# EAGLE schematic happyboardDIP2battery (EAGLE 5.06)

## Sheet 1 of 6
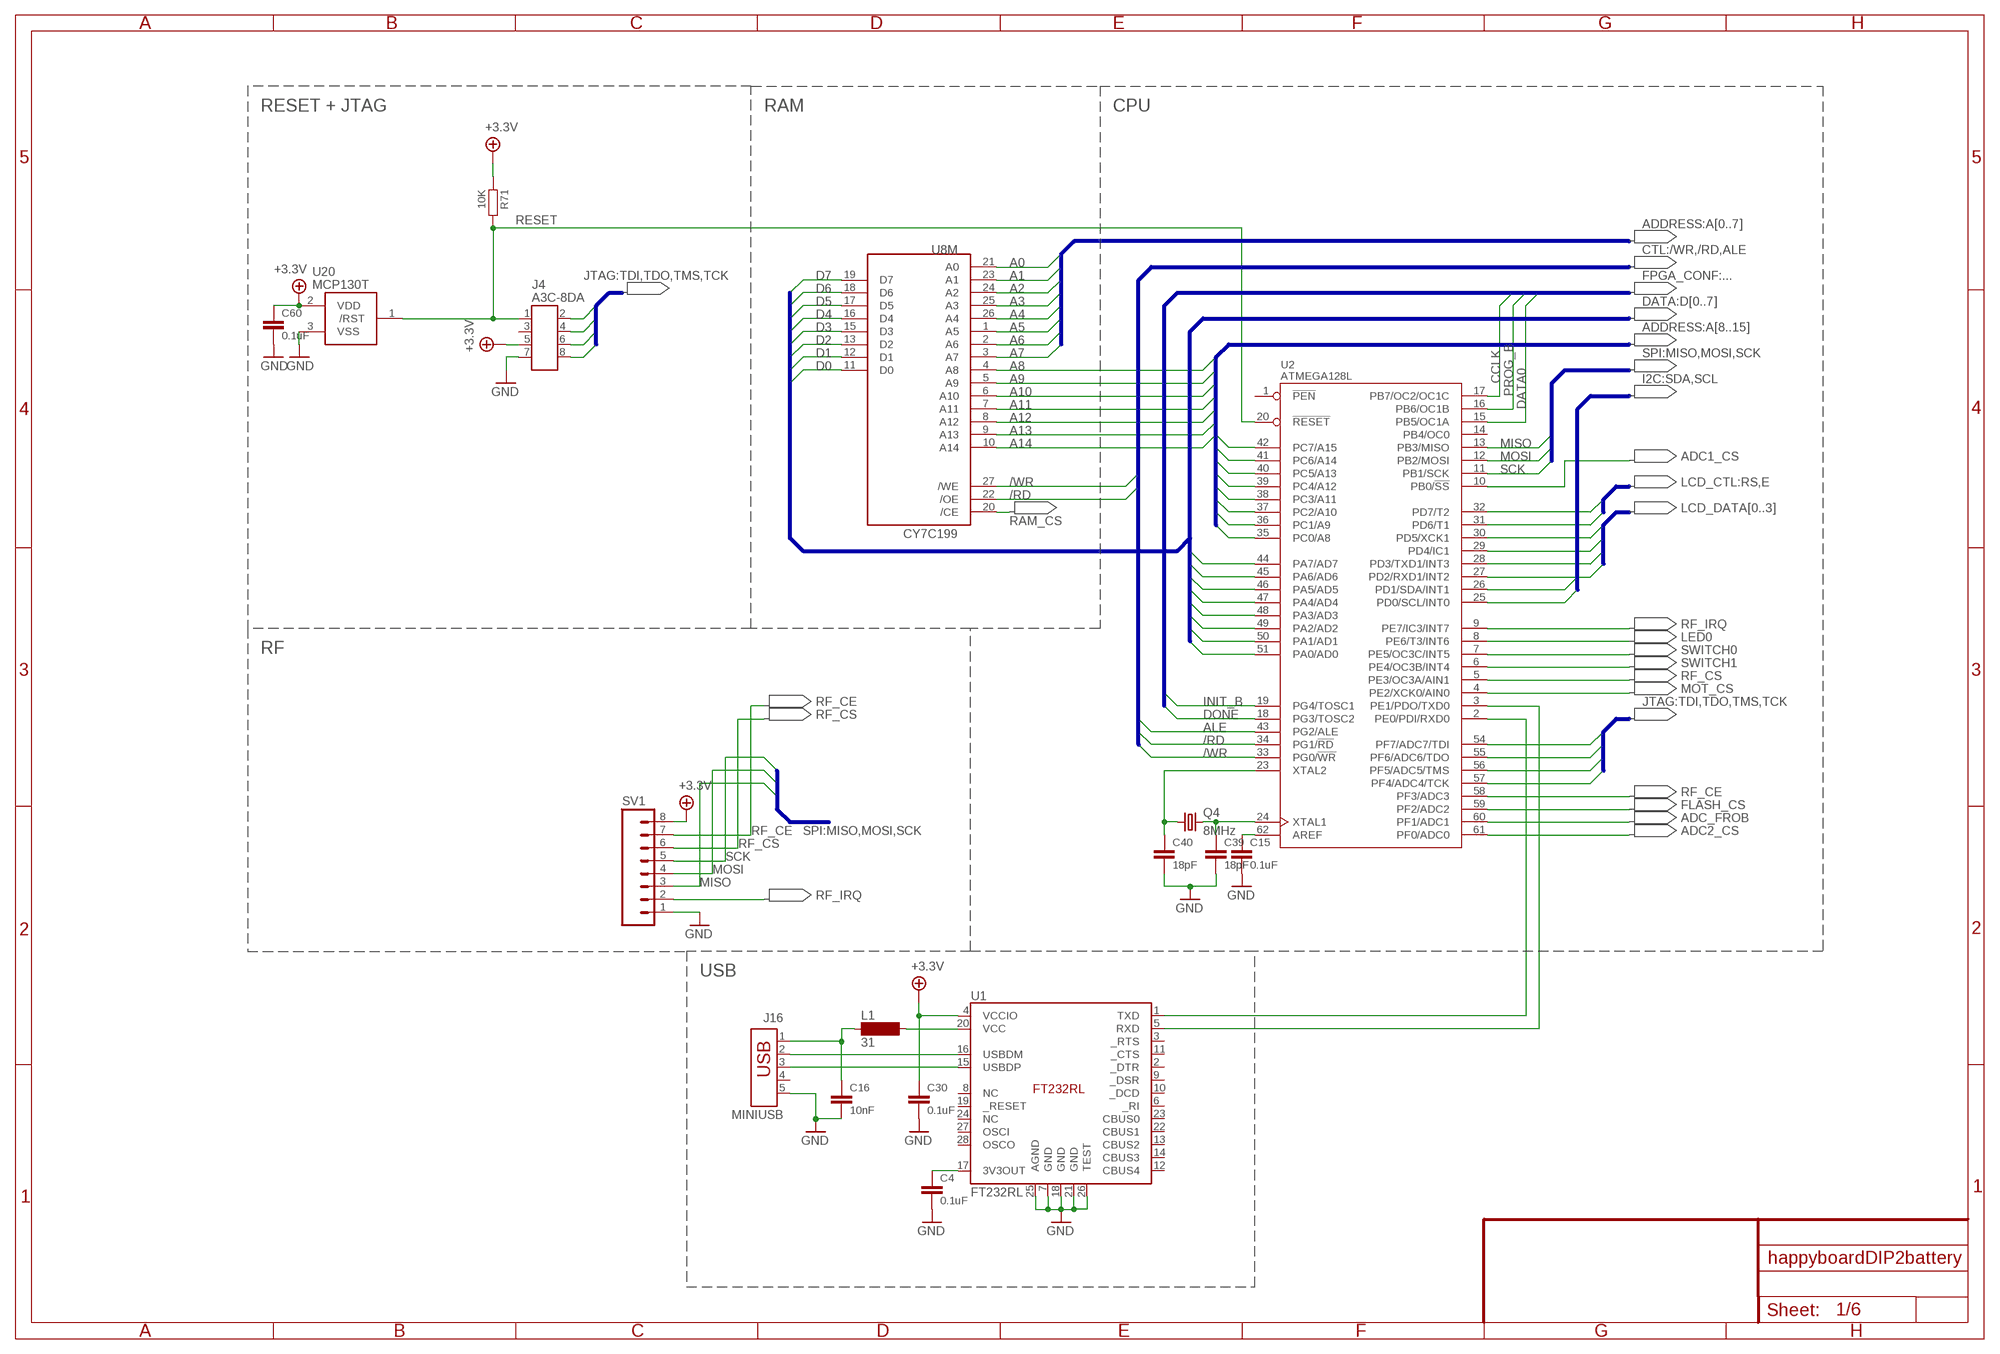
[diagram p0: schematic, sheet 1]

### Parts
C4  0.1uF  C0603  [C0603]
C15  0.1uF  C0603  [C0603]
C16  10nF  C0603  [C0603]
C30  0.1uF  C0603  [C0603]
C39  18pF  C0603  [C0603]
C40  18pF  C0603  [C0603]
C60  0.1uF  C0603  [C0603]
J4  A3C-8DA  [A3C-8DA]
J16  MINIUSB  [UX60A-MB-5SY]
L1  31  SM-1206  [SM-1206]
Q4  8MHz  CRYSTALSM49  [SM49]
R71  10K  R0603  [R0603]
SV1  M08  [1X08]
U1  FT232RL  [SSOP-28]
U2  ATMEGA128L  ATMEGA128-AC  [TQFP64]
U8  CY7C199  CY7C1994  [SOJ28-4]
U20  MCP130T  [SOT23]

### Nets
+3.3V: C30.1 C60.1 J4.5(S5) R71.1 SV1.8 U1.4(VCCIO) U20.2(VDD) ; also sheet 2,3,4,5,6
/RD: U2.34(PG1/!RD) U8.22(M:/OE) ; also sheet 2
/WR: U2.33(PG0/!WR) U8.27(M:/WE) ; also sheet 2
A0: U8.21(M:A0) ; also sheet 2
A1: U8.23(M:A1) ; also sheet 2
A2: U8.24(M:A2) ; also sheet 2
A3: U8.25(M:A3) ; also sheet 2
A4: U8.26(M:A4) ; also sheet 2
A5: U8.1(M:A5) ; also sheet 2
A6: U8.2(M:A6) ; also sheet 2
A7: U8.3(M:A7) ; also sheet 2
A8: U2.35(PC0/A8) U8.4(M:A8) ; also sheet 2
A9: U2.36(PC1/A9) U8.5(M:A9) ; also sheet 2
A10: U2.37(PC2/A10) U8.6(M:A10) ; also sheet 2
A11: U2.38(PC3/A11) U8.7(M:A11) ; also sheet 2
A12: U2.39(PC4/A12) U8.8(M:A12) ; also sheet 2
A13: U2.40(PC5/A13) U8.9(M:A13) ; also sheet 2
A14: U2.41(PC6/A14) U8.10(M:A14) ; also sheet 2
A15: U2.42(PC7/A15) ; also sheet 2
ADC1_CS: U2.10(PB0/!SS) ; also sheet 4
ADC2_CS: U2.61(PF0/ADC0) ; also sheet 4
ADC_FROB: U2.60(PF1/ADC1) ; also sheet 5
ALE: U2.43(PG2/ALE) ; also sheet 2
CCLK: U2.17(PB7/OC2/OC1C) ; also sheet 2
D0: U2.51(PA0/AD0) U8.11(M:D0) ; also sheet 2
D1: U2.50(PA1/AD1) U8.12(M:D1) ; also sheet 2
D2: U2.49(PA2/AD2) U8.13(M:D2) ; also sheet 2
D3: U2.48(PA3/AD3) U8.15(M:D3) ; also sheet 2
D4: U2.47(PA4/AD4) U8.16(M:D4) ; also sheet 2
D5: U2.46(PA5/AD5) U8.17(M:D5) ; also sheet 2
D6: U2.45(PA6/AD6) U8.18(M:D6) ; also sheet 2
D7: U2.44(PA7/AD7) U8.19(M:D7) ; also sheet 2
DATA0: U2.15(PB5/OC1A) ; also sheet 2
DONE: U2.18(PG3/TOSC2) ; also sheet 2
E: U2.31(PD6/T1) ; also sheet 5
FLASH_CS: U2.59(PF2/ADC2) ; also sheet 5
GND: C4.2 C15.2 C16.2 C30.2 C39.2 C40.2 C60.2 J4.7(S7) J16.5 SV1.1 U1.7(GND) U1.18(GND) U1.21(GND) U1.25(AGND) U1.26(TEST) U20.3(VSS) ; also sheet 2,3,4,5,6
INIT_B: U2.19(PG4/TOSC1) ; also sheet 2
LCD_DATA0: U2.27(PD2/RXD1/INT2) ; also sheet 5
LCD_DATA1: U2.28(PD3/TXD1/INT3) ; also sheet 5
LCD_DATA2: U2.29(PD4/IC1) ; also sheet 5
LCD_DATA3: U2.30(PD5/XCK1) ; also sheet 5
LED0: U2.8(PE6/T3/INT6) ; also sheet 5
MISO: SV1.3 U2.13(PB3/MISO) ; also sheet 3,4,5
MOSI: SV1.4 U2.12(PB2/MOSI) ; also sheet 3,4,5
MOT_CS: U2.4(PE2/XCK0/AIN0) ; also sheet 3
N$1: J16.3 U1.15(USBDP)
N$3: C39.1 Q4.2 U2.24(XTAL1)
N$5: C4.1 U1.17(3V3OUT)
N$8: J16.2 U1.16(USBDM)
N$9: L1.2 U1.20(VCC)
N$10: C16.1 J16.1 L1.1
N$14: C40.1 Q4.1 U2.23(XTAL2)
N$42: C15.1 U2.62(AREF)
PE0: U1.1(TXD) U2.2(PE0/PDI/RXD0)
PE1: U1.5(RXD) U2.3(PE1/PDO/TXD0)
PROG_B: U2.16(PB6/OC1B) ; also sheet 2
RAM_CS: U8.20(M:/CE) ; also sheet 2
RESET: J4.1(S1) R71.2 U2.20(!RESET) U20.1(/RST)
RF_CE: SV1.7 U2.58(PF3/ADC3)
RF_CS: SV1.6 U2.5(PE3/OC3A/AIN1)
RF_IRQ: SV1.2 U2.9(PE7/IC3/INT7)
RS: U2.32(PD7/T2) ; also sheet 5
SCK: SV1.5 U2.11(PB1/SCK) ; also sheet 3,4,5
SCL: U2.25(PD0/SCL/INT0) ; also sheet 5
SDA: U2.26(PD1/SDA/INT1) ; also sheet 5
SWITCH0: U2.7(PE5/OC3C/INT5) ; also sheet 5
SWITCH1: U2.6(PE4/OC3B/INT4) ; also sheet 5
TCK: J4.8(S8) U2.57(PF4/ADC4/TCK)
TDI: J4.2(S2) U2.54(PF7/ADC7/TDI)
TDO: J4.4(S4) U2.55(PF6/ADC6/TDO)
TMS: J4.6(S6) U2.56(PF5/ADC5/TMS)
Unconnected: J4.3(S3) J16.4 U1.2(_DTR) U1.3(_RTS) U1.6(_RI) U1.8(NC) U1.9(_DSR) U1.10(_DCD) U1.11(_CTS) U1.12(CBUS4) U1.13(CBUS2) U1.14(CBUS3) U1.19(_RESET) U1.22(CBUS1) U1.23(CBUS0) U1.24(NC) U1.27(OSCI) U1.28(OSCO) U2.1(!PEN) U2.14(PB4/OC0)

### Buses
ADDRESS:A[8..15]
DATA:D[0..7]
CTL:/WR,/RD,ALE
SPI:MISO,MOSI,SCK
I2C:SDA,SCL
FPGA_CONF:CCLK,DONE,PROG_B,INIT_B,DATA0
LCD_DATA[0..3]
LCD_CTL:RS,E
ADDRESS:A[0..7]
JTAG:TDI,TDO,TMS,TCK

### Notes on the sheet
- RESET + JTAG | RAM | CPU
- FPGA_CONF:...
- RF
- USB

## Sheet 2 of 6
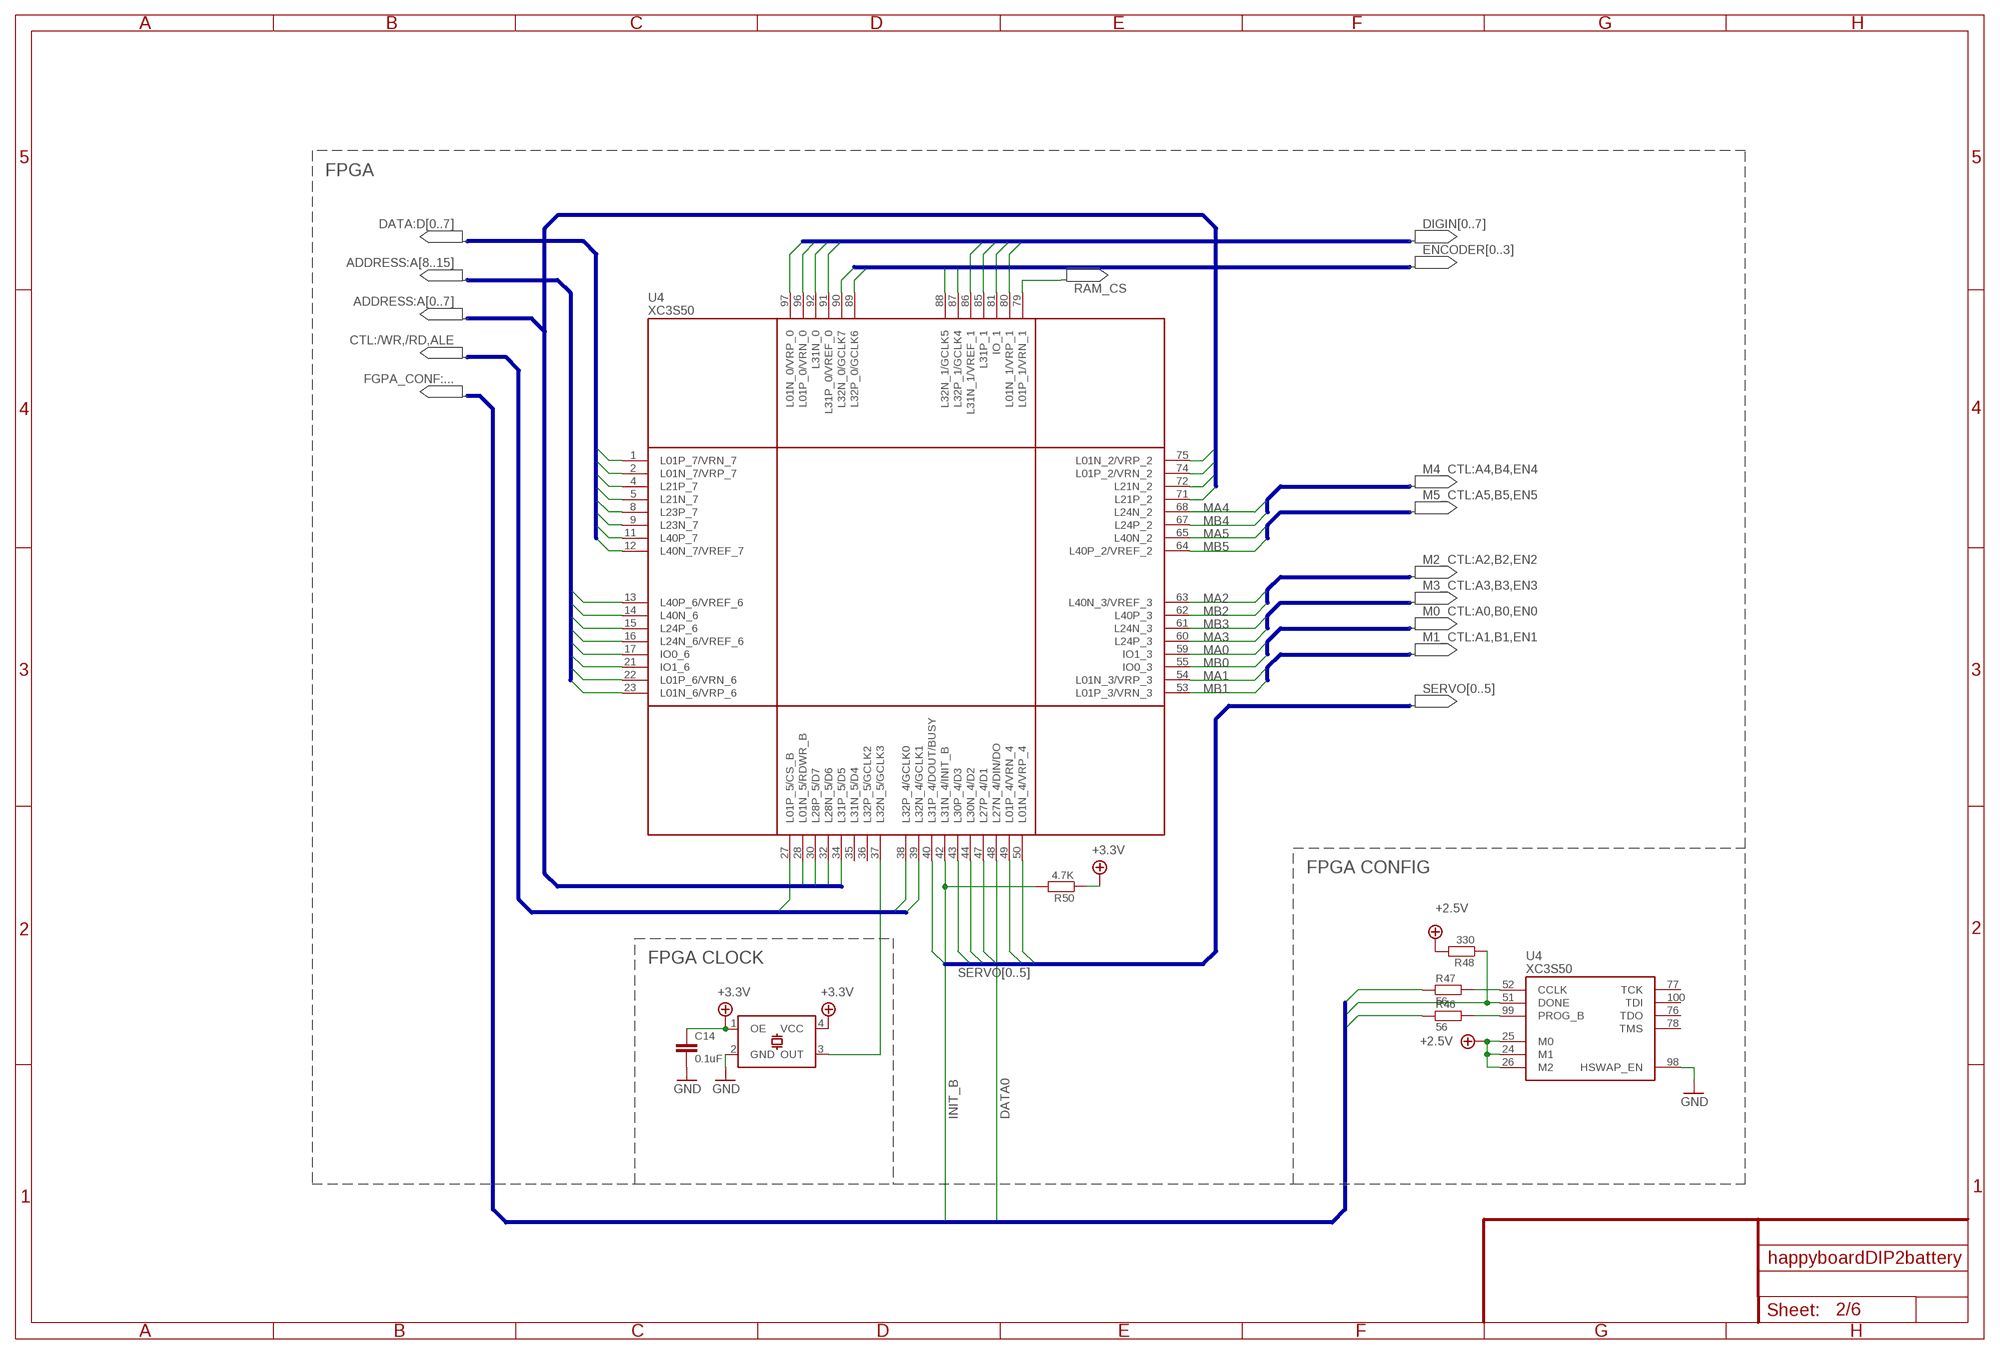
[diagram p1: schematic, sheet 2]

### Parts
C14  0.1uF  C0603  [C0603]
Q2  8MHz  CITIZEN-CRYSTAL  [CITIZEN-CRYSTAL]
R46  56  R0603  [R0603]
R47  56  R0603  [R0603]
R48  330  R0603  [R0603]
R50  4.7K  R0603  [R0603]
U4  XC3S50  [VQ100]

### Nets
+2.5V: R48.2 U4.24(M1) U4.25(M0) U4.26(M2) ; also sheet 6
+3.3V: C14.1 Q2.1(OE) Q2.4(VCC) R50.1 ; also sheet 1,3,4,5,6
/RD: U4.39(L32N_4/GCLK1) ; also sheet 1
/WR: U4.38(L32P_4/GCLK0) ; also sheet 1
A0: U4.28(L01N_5/RDWR_B) ; also sheet 1
A1: U4.30(L28P_5/D7) ; also sheet 1
A2: U4.32(L28N_5/D6) ; also sheet 1
A3: U4.34(L31P_5/D5) ; also sheet 1
A4: U4.75(L01N_2/VRP_2) ; also sheet 1
A5: U4.74(L01P_2/VRN_2) ; also sheet 1
A6: U4.72(L21N_2) ; also sheet 1
A7: U4.71(L21P_2) ; also sheet 1
A8: U4.23(L01N_6/VRP_6) ; also sheet 1
A9: U4.22(L01P_6/VRN_6) ; also sheet 1
A10: U4.21(IO1_6) ; also sheet 1
A11: U4.17(IO0_6) ; also sheet 1
A12: U4.16(L24N_6/VREF_6) ; also sheet 1
A13: U4.15(L24P_6) ; also sheet 1
A14: U4.14(L40N_6) ; also sheet 1
A15: U4.13(L40P_6/VREF_6) ; also sheet 1
ALE: U4.27(L01P_5/CS_B) ; also sheet 1
CCLK: R47.1 ; also sheet 1
D0: U4.1(L01P_7/VRN_7) ; also sheet 1
D1: U4.2(L01N_7/VRP_7) ; also sheet 1
D2: U4.4(L21P_7) ; also sheet 1
D3: U4.5(L21N_7) ; also sheet 1
D4: U4.8(L23P_7) ; also sheet 1
D5: U4.9(L23N_7) ; also sheet 1
D6: U4.11(L40P_7) ; also sheet 1
D7: U4.12(L40N_7/VREF_7) ; also sheet 1
DATA0: U4.48(L27N_4/DIN/DO) ; also sheet 1
DIGIN0: U4.80(L01N_1/VRP_1) ; also sheet 4
DIGIN1: U4.81(IO_1) ; also sheet 4
DIGIN2: U4.85(L31P_1) ; also sheet 4
DIGIN3: U4.86(L31N_1/VREF_1) ; also sheet 4
DIGIN4: U4.91(L31P_0/VREF_0) ; also sheet 4
DIGIN5: U4.92(L31N_0) ; also sheet 4
DIGIN6: U4.96(L01P_0/VRN_0) ; also sheet 4
DIGIN7: U4.97(L01N_0/VRP_0) ; also sheet 4
DONE: R48.1 U4.51(DONE) ; also sheet 1
ENCODER0: U4.87(L32P_1/GCLK4) ; also sheet 4
ENCODER1: U4.88(L32N_1/GCLK5) ; also sheet 4
ENCODER2: U4.90(L32N_0/GCLK7) ; also sheet 4
ENCODER3: U4.89(L32P_0/GCLK6) ; also sheet 4
GND: C14.2 Q2.2(GND) U4.98(HSWAP_EN) ; also sheet 1,3,4,5,6
INIT_B: R50.2 U4.42(L31N_4/INIT_B) ; also sheet 1
MA0: U4.59(IO1_3) ; also sheet 3
MA1: U4.54(L01N_3/VRP_3) ; also sheet 3
MA2: U4.63(L40N_3/VREF_3) ; also sheet 3
MA3: U4.60(L24P_3) ; also sheet 3
MA4: U4.68(L24N_2) ; also sheet 3
MA5: U4.65(L40N_2) ; also sheet 3
MB0: U4.55(IO0_3) ; also sheet 3
MB1: U4.53(L01P_3/VRN_3) ; also sheet 3
MB2: U4.62(L40P_3) ; also sheet 3
MB3: U4.61(L24N_3) ; also sheet 3
MB4: U4.67(L24P_2) ; also sheet 3
MB5: U4.64(L40P_2/VREF_2) ; also sheet 3
N$97: Q2.3(OUT) U4.37(L32N_5/GCLK3)
N$99: R46.2 U4.99(PROG_B)
N$100: R47.2 U4.52(CCLK)
PROG_B: R46.1 ; also sheet 1
RAM_CS: U4.79(L01P_1/VRN_1) ; also sheet 1
SERVO0: U4.40(L31P_4/DOUT/BUSY) ; also sheet 4
SERVO1: U4.43(L30P_4/D3) ; also sheet 4
SERVO2: U4.44(L30N_4/D2) ; also sheet 4
SERVO3: U4.47(L27P_4/D1) ; also sheet 4
SERVO4: U4.49(L01P_4/VRN_4) ; also sheet 4
SERVO5: U4.50(L01N_4/VRP_4) ; also sheet 4
Unconnected: U4.35(L31N_5/D4) U4.36(L32P_5/GCLK2) U4.76(TDO) U4.77(TCK) U4.78(TMS) U4.100(TDI)

### Buses
FPGA_CONF:CCLK,DONE,PROG_B,INIT_B,DATA0
ADDRESS:A[8..15]
DATA:D[0..7]
CTL:/WR,/RD,ALE
SERVO[0..5]
M0_CTL:A0,B0,EN0
M1_CTL:A1,B1,EN1
M2_CTL:A2,B2,EN2
M3_CTL:A3,B3,EN3
M4_CTL:A4,B4,EN4
M5_CTL:A5,B5,EN5
ENCODER[0..3]
DIGIN[0..7]
ADDRESS:A[0..7]

### Notes on the sheet
- FPGA
- FGPA_CONF:...
- FPGA CONFIG
- FPGA CLOCK

## Sheet 3 of 6
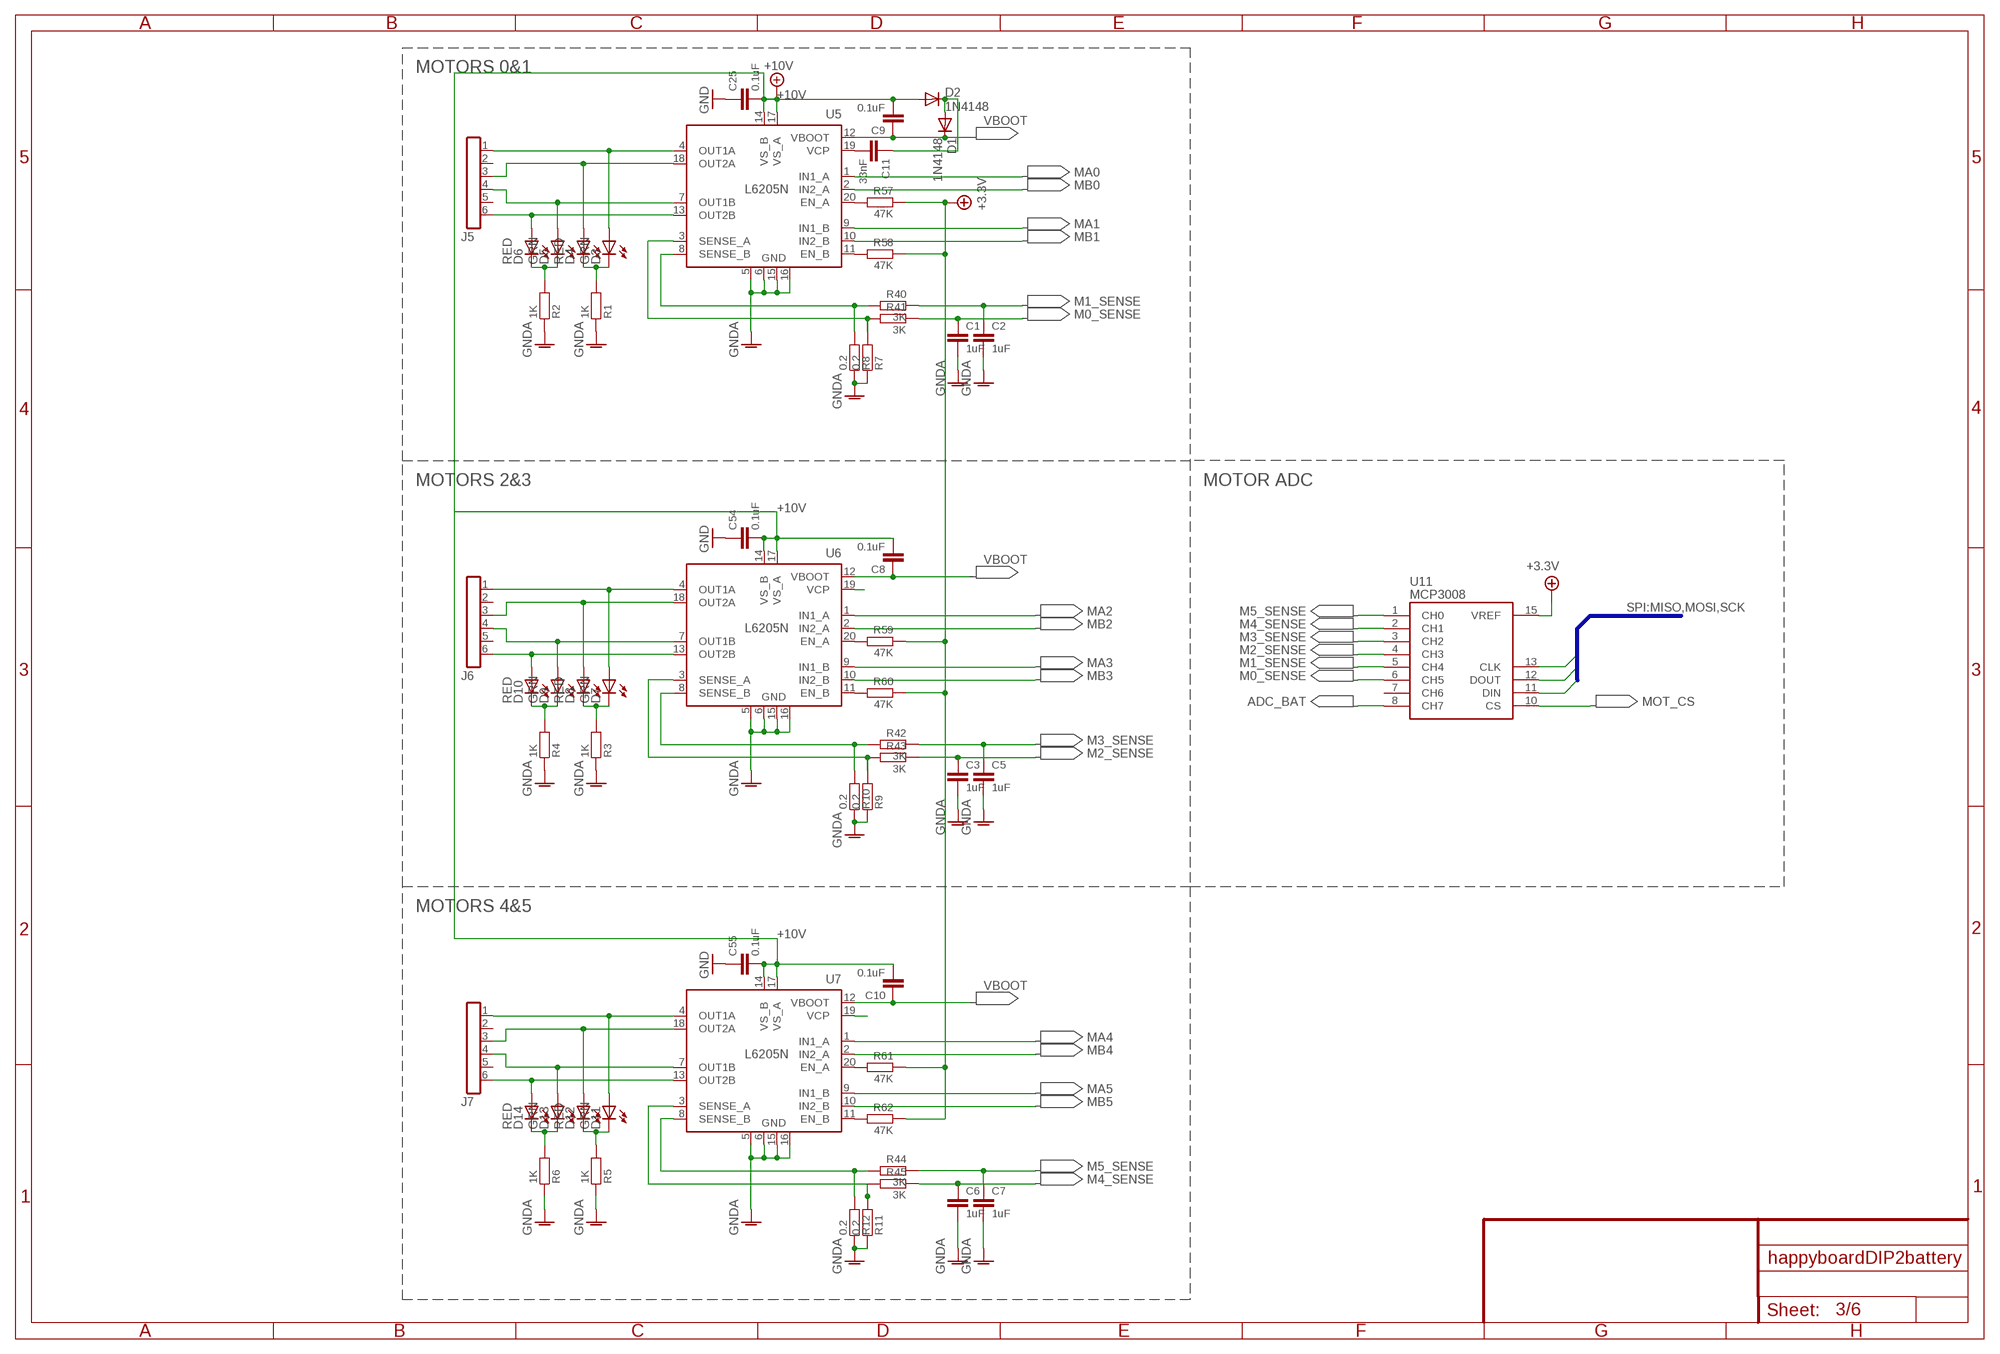
[diagram p2: schematic, sheet 3]

### Parts
C1  1uF  C0603  [C0603]
C2  1uF  C0603  [C0603]
C3  1uF  C0603  [C0603]
C5  1uF  C0603  [C0603]
C6  1uF  C0603  [C0603]
C7  1uF  C0603  [C0603]
C8  0.1uF  C0603  [C0603]
C9  0.1uF  C0603  [C0603]
C10  0.1uF  C0603  [C0603]
C11  33nF  C0603  [C0603]
C25  0.1uF  C0603  [C0603]
C54  0.1uF  C0603  [C0603]
C55  0.1uF  C0603  [C0603]
D1  1N4148  DIODE-SOD323  [SOD323]
D2  1N4148  DIODE-SOD323  [SOD323]
D3  GRN  LED  [CHIP-LED0603]
D4  RED  LED  [CHIP-LED0603]
D5  GRN  LED  [CHIP-LED0603]
D6  RED  LED  [CHIP-LED0603]
D7  GRN  LED  [CHIP-LED0603]
D8  RED  LED  [CHIP-LED0603]
D9  GRN  LED  [CHIP-LED0603]
D10  RED  LED  [CHIP-LED0603]
D11  GRN  LED  [CHIP-LED0603]
D12  RED  LED  [CHIP-LED0603]
D13  GRN  LED  [CHIP-LED0603]
D14  RED  LED  [CHIP-LED0603]
J5  6x1 Pin Female Header  FE06-1  [FE06]
J6  6x1 Pin Female Header  FE06-1  [FE06]
J7  6x1 Pin Female Header  FE06-1  [FE06]
R1  1K  R0603  [R0603]
R2  1K  R0603  [R0603]
R3  1K  R0603  [R0603]
R4  1K  R0603  [R0603]
R5  1K  R0603  [R0603]
R6  1K  R0603  [R0603]
R7  0.2  R1206  [R1206]
R8  0.2  R1206  [R1206]
R9  0.2  R1206  [R1206]
R10  0.2  R1206  [R1206]
R11  0.2  R1206  [R1206]
R12  0.2  R1206  [R1206]
R40  3K  R0603  [R0603]
R41  3K  R0603  [R0603]
R42  3K  R0603  [R0603]
R43  3K  R0603  [R0603]
R44  3K  R0603  [R0603]
R45  3K  R0603  [R0603]
R57  47K  R0603  [R0603]
R58  47K  R0603  [R0603]
R59  47K  R0603  [R0603]
R60  47K  R0603  [R0603]
R61  47K  R0603  [R0603]
R62  47K  R0603  [R0603]
U5  L6205N  [DIL20]
U6  L6205N  [DIL20]
U7  L6205N  [DIL20]
U11  MCP3008  [SO16]

### Nets
+3.3V: R57.1 R58.1 R59.1 R60.1 R61.1 R62.1 U11.15(1:VREF) ; also sheet 1,2,4,5,6
+10V: C8.2 C9.2 C10.2 C25.2 C54.2 C55.2 D2.A U5.14(VS_B) U5.17(VS_A) U6.14(VS_B) U6.17(VS_A) U7.14(VS_B) U7.17(VS_A) ; also sheet 6
ADC_BAT: U11.8(1:CH7) ; also sheet 6
GND: C25.1 C54.1 C55.1 ; also sheet 1,2,4,5,6
GNDA: C1.2 C2.2 C3.2 C5.2 C6.2 C7.2 R1.1 R2.1 R3.1 R4.1 R5.1 R6.1 R7.1 R8.1 R9.1 R10.1 R11.1 R12.1 U5.5(GND) U5.6(GND) U5.15(GND) U5.16(GND) U6.5(GND) U6.6(GND) U6.15(GND) U6.16(GND) U7.5(GND) U7.6(GND) U7.15(GND) U7.16(GND) ; also sheet 4,6
M0_SENSE: C1.1 R41.1 U11.6(1:CH5)
M1_SENSE: C2.1 R40.1 U11.5(1:CH4)
M2_SENSE: C3.1 R43.1 U11.4(1:CH3)
M3_SENSE: C5.1 R42.1 U11.3(1:CH2)
M4_SENSE: C6.1 R45.1 U11.2(1:CH1)
M5_SENSE: C7.1 R44.1 U11.1(1:CH0)
MA0: U5.1(IN1_A) ; also sheet 2
MA1: U5.9(IN1_B) ; also sheet 2
MA2: U6.1(IN1_A) ; also sheet 2
MA3: U6.9(IN1_B) ; also sheet 2
MA4: U7.1(IN1_A) ; also sheet 2
MA5: U7.9(IN1_B) ; also sheet 2
MB0: U5.2(IN2_A) ; also sheet 2
MB1: U5.10(IN2_B) ; also sheet 2
MB2: U6.2(IN2_A) ; also sheet 2
MB3: U6.10(IN2_B) ; also sheet 2
MB4: U7.2(IN2_A) ; also sheet 2
MB5: U7.10(IN2_B) ; also sheet 2
MISO: U11.12(1:DOUT) ; also sheet 1,4,5
MOSI: U11.11(1:DIN) ; also sheet 1,4,5
MOT_CS: U11.10(1:CS) ; also sheet 1
N$2: D11.A J7.1 U7.4(OUT1A)
N$13: D14.A J7.6 U7.13(OUT2B)
N$19: D13.A J7.4 U7.7(OUT1B)
N$25: D12.A J7.3 U7.18(OUT2A)
N$26: D3.A J5.1 U5.4(OUT1A)
N$27: D6.A J5.6 U5.13(OUT2B)
N$28: D5.A J5.4 U5.7(OUT1B)
N$29: D4.A J5.3 U5.18(OUT2A)
N$30: D7.A J6.1 U6.4(OUT1A)
N$31: D8.A J6.3 U6.18(OUT2A)
N$32: D9.A J6.4 U6.7(OUT1B)
N$33: D10.A J6.6 U6.13(OUT2B)
N$34: D5.C D6.C R2.2
N$35: D3.C D4.C R1.2
N$36: D9.C D10.C R4.2
N$37: D7.C D8.C R3.2
N$38: D11.C D12.C R5.2
N$39: D13.C D14.C R6.2
N$43: C11.1 D1.A D2.C
N$44: R11.2 R45.2 U7.3(SENSE_A)
N$45: R8.2 R40.2 U5.8(SENSE_B)
N$54: U7.19(VCP)
N$58: R57.2 U5.20(EN_A)
N$59: R58.2 U5.11(EN_B)
N$60: R59.2 U6.20(EN_A)
N$61: R60.2 U6.11(EN_B)
N$62: R10.2 R42.2 U6.8(SENSE_B)
N$63: R7.2 R41.2 U5.3(SENSE_A)
N$64: R61.2 U7.20(EN_A)
N$65: R62.2 U7.11(EN_B)
N$70: C11.2 U5.19(VCP)
N$93: U6.19(VCP)
N$94: R9.2 R43.2 U6.3(SENSE_A)
N$95: R12.2 R44.2 U7.8(SENSE_B)
SCK: U11.13(1:CLK) ; also sheet 1,4,5
VBOOT: C8.1 C9.1 C10.1 D1.C U5.12(VBOOT) U6.12(VBOOT) U7.12(VBOOT)
Unconnected: J5.2 J5.5 J6.2 J6.5 J7.2 J7.5 U11.7(1:CH6)

### Buses
SPI:MISO,MOSI,SCK

### Notes on the sheet
- MOTORS 0&1
- MOTORS 2&3 | MOTOR ADC
- MOTORS 4&5

## Sheet 4 of 6
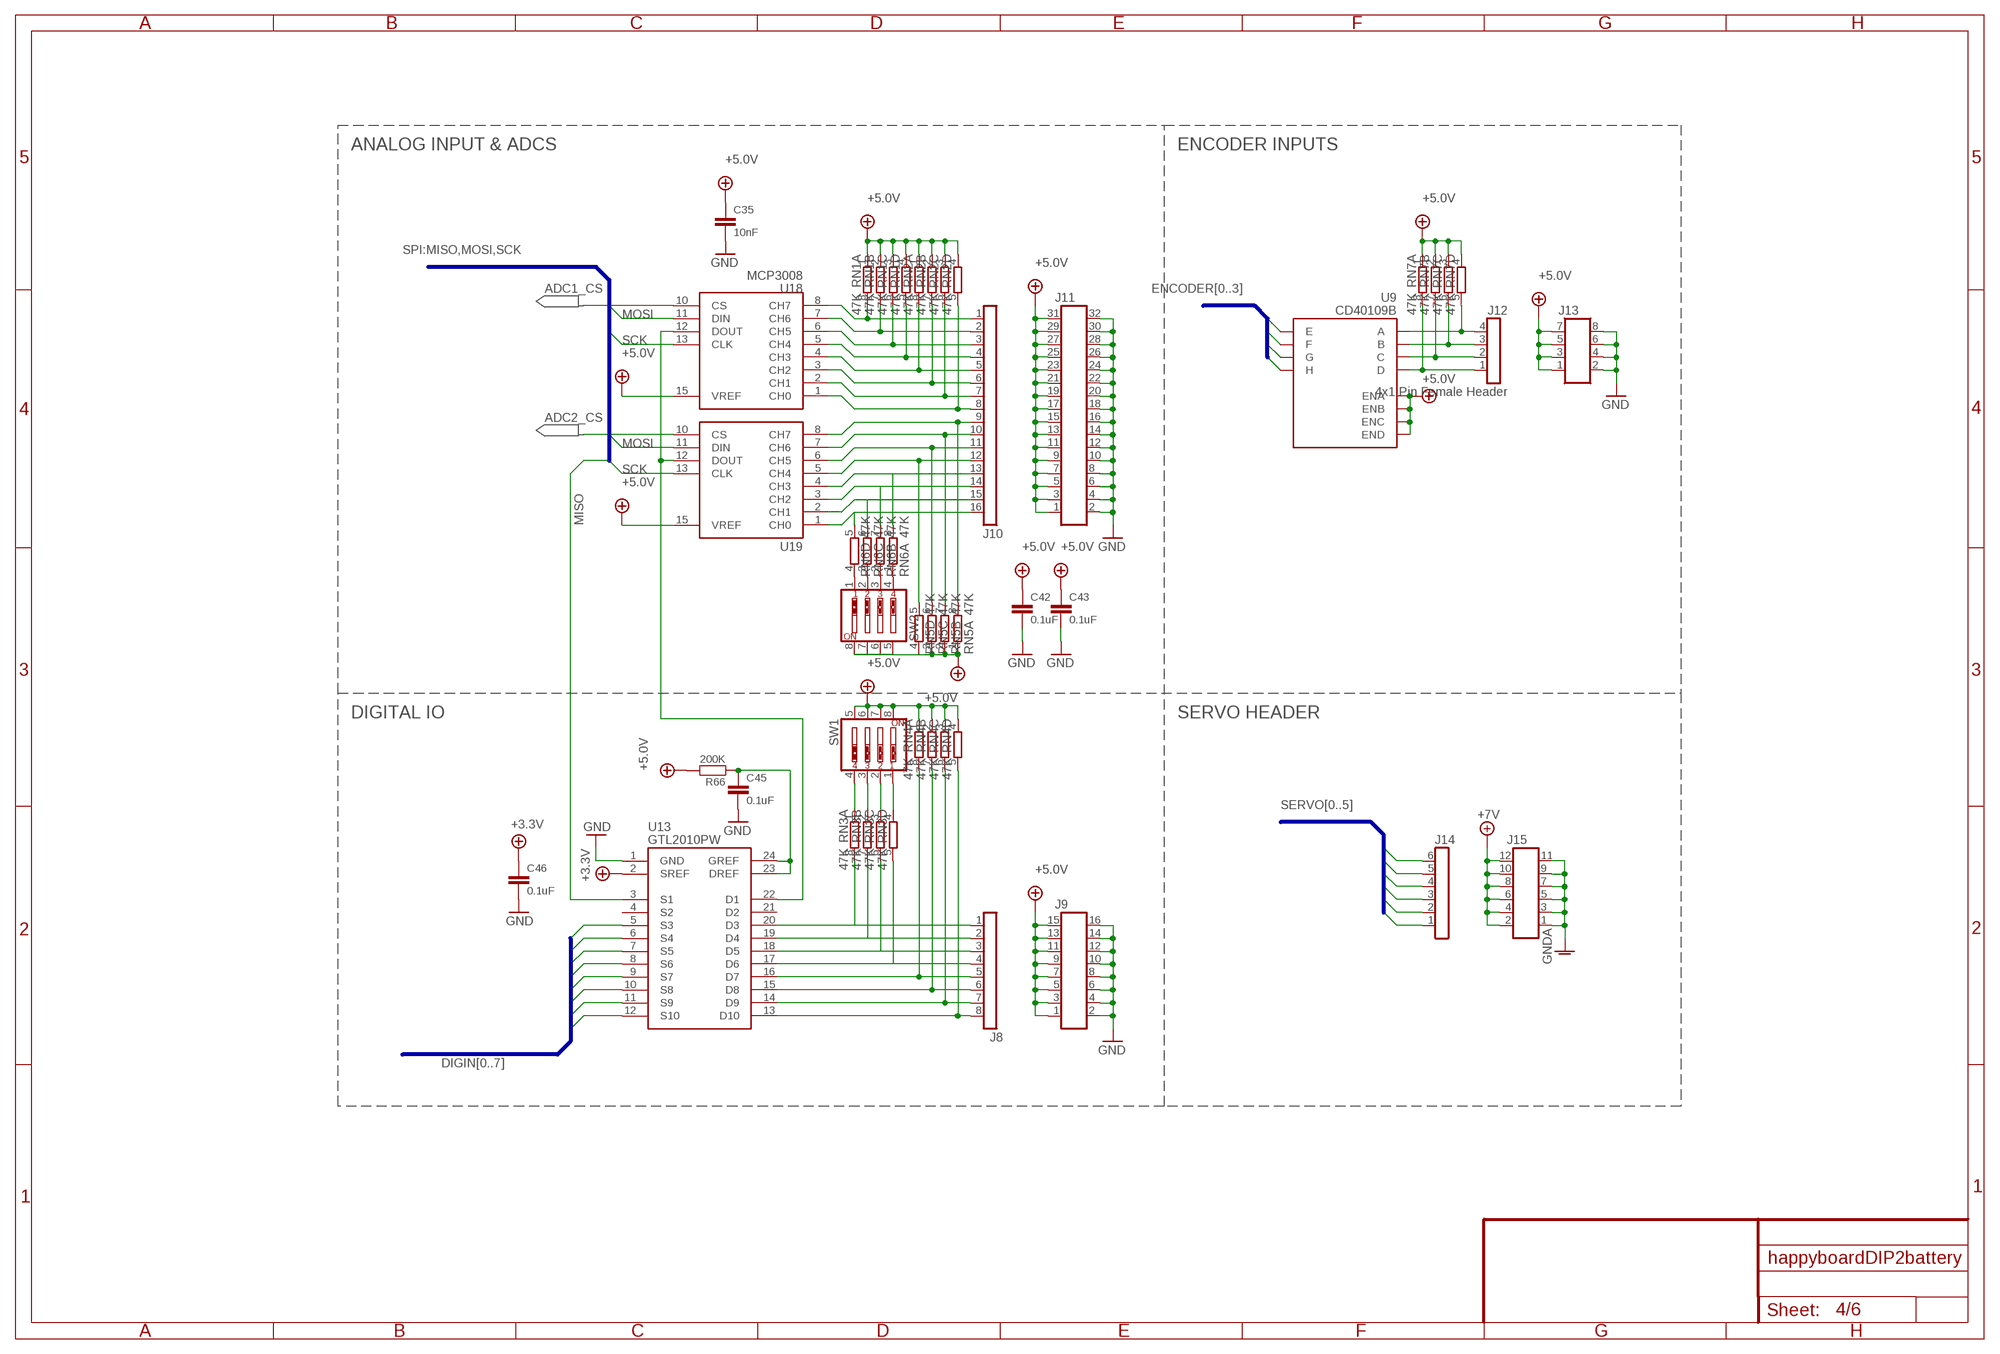
[diagram p3: schematic, sheet 4]

### Parts
C35  10nF  C0603  [C0603]
C42  0.1uF  C0603  [C0603]
C43  0.1uF  C0603  [C0603]
C45  0.1uF  C0603  [C0603]
C46  0.1uF  C0603  [C0603]
J8  8x1 Pin Female Header  FE08-1  [FE08]
J9  8x2 Pin Female Header  FE08-2  [FE08-2]
J10  16x1 Pin Female Header  FE16-1  [FE16-1]
J11  16x2 Pin Female Header  FE16-2  [FE16-2]
J12  4x1 Pin Female Header  FE04-1  [FE04-1]
J13  4x2 Pin Female Header  FE04-2  [FE04-2]
J14  6x1 Pin Male Header  MA06-1  [MA06-1]
J15  6x2 Pin Male Header  MA06-2  [MA06-2]
R66  200K  R0603  [R0603]
RN1  47K  4R-N0603-ARC  [0603-ARC]
RN2  47K  4R-N0603-ARC  [0603-ARC]
RN3  47K  4R-N0603-ARC  [0603-ARC]
RN4  47K  4R-N0603-ARC  [0603-ARC]
RN5  47K  4R-N0603-ARC  [0603-ARC]
RN6  47K  4R-N0603-ARC  [0603-ARC]
RN7  47K  4R-N0603-ARC  [0603-ARC]
SW1  SW_DIP-4  [EDG-04]
SW2  SW_DIP-4  [EDG-04]
U9  CD40109B  [TSSOP16]
U13  GTL2010PW  [TSSOP24]
U18  MCP3008  [SO16]
U19  MCP3008  [SO16]

### Nets
+3.3V: C46.1 U13.2(SREF) ; also sheet 1,2,3,5,6
+5.0V: C35.1 C42.1 C43.1 J9.1 J9.3 J9.5 J9.7 J9.9 J9.11 J9.13 J9.15 J11.1 J11.3 J11.5 J11.7 J11.9 J11.11 J11.13 J11.15 J11.17 J11.19 J11.21 J11.23 J11.25 J11.27 J11.29 J11.31 J13.1 J13.3 J13.5 J13.7 R66.2 RN1.1 RN1.2 RN1.3 RN1.4 RN2.1 RN2.2 RN2.3 RN2.4 RN4.1 RN4.2 RN4.3 RN4.4 RN5.1 RN5.2 RN5.3 RN5.4 RN7.1 RN7.2 RN7.3 RN7.4 SW1.5 SW1.6 SW1.7 SW1.8 SW2.5 SW2.6 SW2.7 SW2.8 U9.2(ENA) U9.7(ENB) U9.9(ENC) U9.15(END) U18.15(1:VREF) U19.15(1:VREF) ; also sheet 6
ADC1_CS: U18.10(1:CS) ; also sheet 1
ADC2_CS: U19.10(1:CS) ; also sheet 1
DIGIN0: U13.5(S3) ; also sheet 2
DIGIN1: U13.6(S4) ; also sheet 2
DIGIN2: U13.7(S5) ; also sheet 2
DIGIN3: U13.8(S6) ; also sheet 2
DIGIN4: U13.9(S7) ; also sheet 2
DIGIN5: U13.10(S8) ; also sheet 2
DIGIN6: U13.11(S9) ; also sheet 2
DIGIN7: U13.12(S10) ; also sheet 2
ENCODER0: U9.13(H) ; also sheet 2
ENCODER1: U9.11(G) ; also sheet 2
ENCODER2: U9.5(F) ; also sheet 2
ENCODER3: U9.4(E) ; also sheet 2
GND: C35.2 C42.2 C43.2 C45.2 C46.2 J9.2 J9.4 J9.6 J9.8 J9.10 J9.12 J9.14 J9.16 J11.2 J11.4 J11.6 J11.8 J11.10 J11.12 J11.14 J11.16 J11.18 J11.20 J11.22 J11.24 J11.26 J11.28 J11.30 J11.32 J13.2 J13.4 J13.6 J13.8 U13.1(GND) ; also sheet 1,2,3,5,6
GNDA: J15.1 J15.3 J15.5 J15.7 J15.9 J15.11 ; also sheet 3,6
MISO: U13.3(S1) ; also sheet 1,3,5
MOSI: U18.11(1:DIN) U19.11(1:DIN) ; also sheet 1,3,5
N$4: RN3.1 SW1.4
N$6: J15.2 J15.4 J15.6 J15.8 J15.10 J15.12 ; supply symbol labelled +7V
N$7: J10.1 RN1.8 U18.8(1:CH7)
N$11: J10.2 RN1.7 U18.7(1:CH6)
N$15: RN6.1 SW2.4
N$16: J10.15 RN6.6 U19.2(1:CH1)
N$17: J10.14 RN6.7 U19.3(1:CH2)
N$20: J10.13 RN6.8 U19.4(1:CH3)
N$22: J10.12 RN5.5 U19.5(1:CH4)
N$24: J10.11 RN5.6 U19.6(1:CH5)
N$46: J10.10 RN5.7 U19.7(1:CH6)
N$47: J10.9 RN5.8 U19.8(1:CH7)
N$48: J10.8 RN2.5 U18.1(1:CH0)
N$49: J10.7 RN2.6 U18.2(1:CH1)
N$50: J10.6 RN2.7 U18.3(1:CH2)
N$51: J10.5 RN2.8 U18.4(1:CH3)
N$52: J10.4 RN1.5 U18.5(1:CH4)
N$53: J10.3 RN1.6 U18.6(1:CH5)
N$57: RN3.2 SW1.3
N$66: J12.1 RN7.8 U9.14(D)
N$67: J12.2 RN7.7 U9.10(C)
N$68: J12.3 RN7.6 U9.6(B)
N$69: J12.4 RN7.5 U9.3(A)
N$71: J8.8 RN4.5 U13.13(D10)
N$72: J8.7 RN4.6 U13.14(D9)
N$73: J8.6 RN4.7 U13.15(D8)
N$74: J8.5 RN4.8 U13.16(D7)
N$75: J8.4 RN3.5 U13.17(D6)
N$76: J8.3 RN3.6 U13.18(D5)
N$77: J8.2 RN3.7 U13.19(D4)
N$78: J8.1 RN3.8 U13.20(D3)
N$82: RN3.3 SW1.2
N$87: C45.1 R66.1 U13.23(DREF) U13.24(GREF)
N$89: U13.22(D1) U18.12(1:DOUT) U19.12(1:DOUT)
N$96: RN3.4 SW1.1
N$98: J10.16 RN6.5 U19.1(1:CH0)
N$101: RN6.2 SW2.3
N$102: RN6.3 SW2.2
N$103: RN6.4 SW2.1
SCK: U18.13(1:CLK) U19.13(1:CLK) ; also sheet 1,3,5
SERVO0: J14.1 ; also sheet 2
SERVO1: J14.2 ; also sheet 2
SERVO2: J14.3 ; also sheet 2
SERVO3: J14.4 ; also sheet 2
SERVO4: J14.5 ; also sheet 2
SERVO5: J14.6 ; also sheet 2
Unconnected: U13.4(S2) U13.21(D2)

### Buses
SERVO[0..5]
DIGIN[0..7]
SPI:MISO,MOSI,SCK
ENCODER[0..3]

### Notes on the sheet
- ANALOG INPUT & ADCS | ENCODER INPUTS
- DIGITAL IO | SERVO HEADER

## Sheet 5 of 6
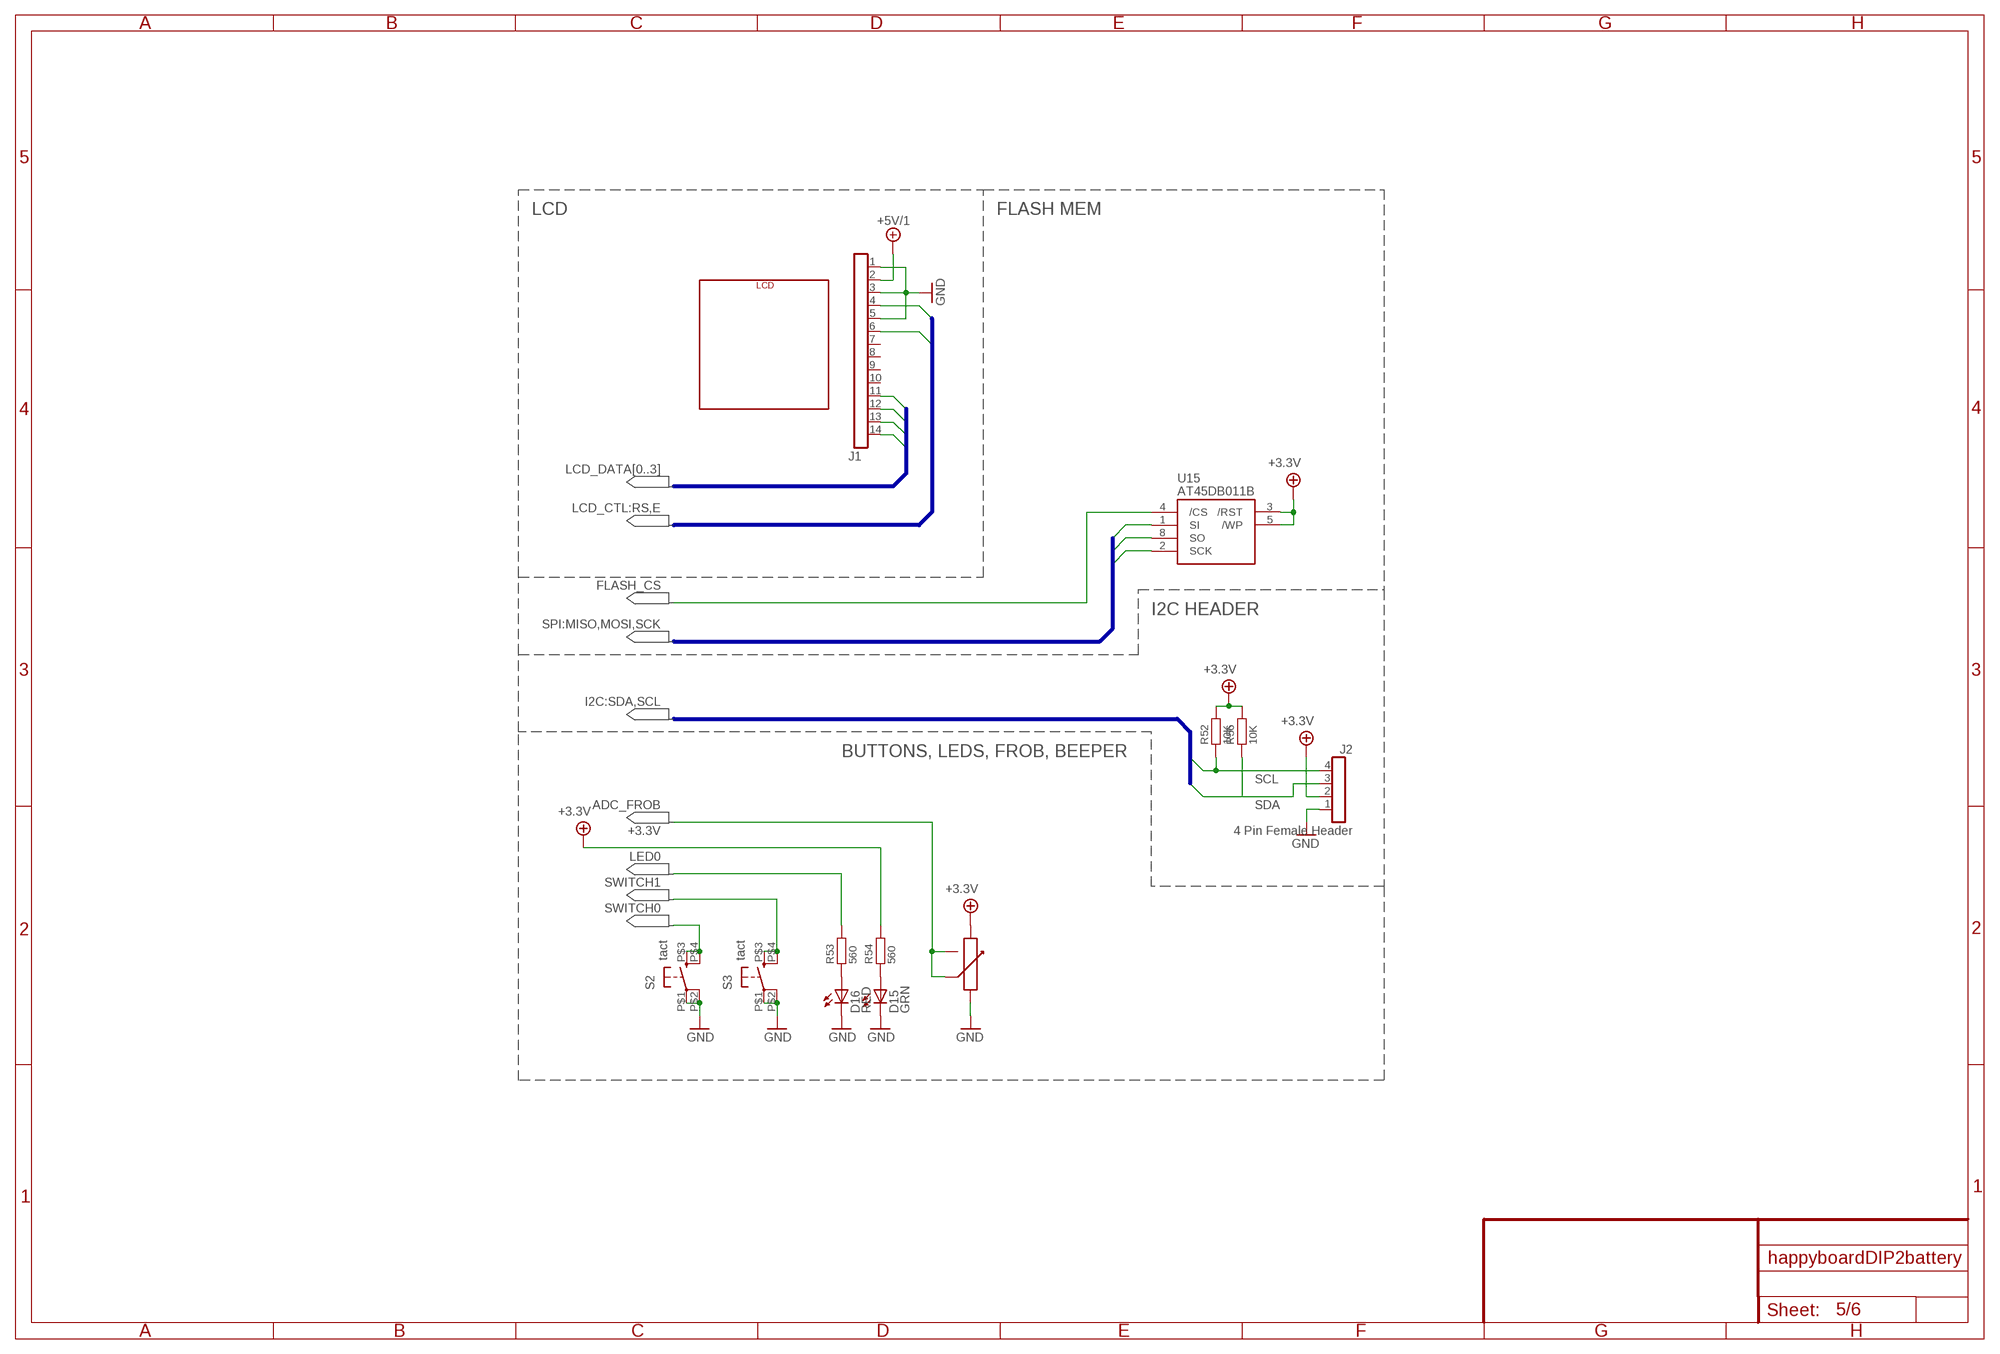
[diagram p4: schematic, sheet 5]

### Parts
D15  GRN  LED  [CHIP-LED0603]
D16  RED  LED  [CHIP-LED0603]
DISP1  16X2LCD  [16X2LCD]
J1  14 Pin Female Header  FE14-1  [FE14]
J2  4 Pin Female Header  FE04-1  [FE04-1]
R52  10K  R0603  [R0603]
R53  560  R0603  [R0603]
R54  560  R0603  [R0603]
R56  10K  R0603  [R0603]
S2  tact  TL3301  [TL3301]
S3  tact  TL3301  [TL3301]
U15  AT45DB011B  [SO8]
VR1  FROBKNOB  [FROBKNOB]

### Nets
+3.3V: J2.2 R52.2 R54.2 R56.2 U15.3(1:/RST) U15.5(1:/WP) VR1.1 ; also sheet 1,2,3,4,6
+5V/1: J1.2 ; also sheet 6
ADC_FROB: VR1.2A VR1.2B ; also sheet 1
E: J1.6 ; also sheet 1
FLASH_CS: U15.4(1:/CS) ; also sheet 1
GND: D15.C D16.C J1.1 J1.3 J1.5 J2.1 S2.P$1(P) S2.P$2(P1) S3.P$1(P) S3.P$2(P1) VR1.3 ; also sheet 1,2,3,4,6
LCD_DATA0: J1.11 ; also sheet 1
LCD_DATA1: J1.12 ; also sheet 1
LCD_DATA2: J1.13 ; also sheet 1
LCD_DATA3: J1.14 ; also sheet 1
LED0: R53.2 ; also sheet 1
MISO: U15.8(1:SO) ; also sheet 1,3,4
MOSI: U15.1(1:SI) ; also sheet 1,3,4
N$40: D16.A R53.1
N$41: D15.A R54.1
RS: J1.4 ; also sheet 1
SCK: U15.2(1:SCK) ; also sheet 1,3,4
SCL: J2.4 R52.1 ; also sheet 1
SDA: J2.3 R56.1 ; also sheet 1
SWITCH0: S2.P$3(S) S2.P$4(S1) ; also sheet 1
SWITCH1: S3.P$3(S) S3.P$4(S1) ; also sheet 1
Unconnected: J1.7 J1.8 J1.9 J1.10

### Buses
LCD_DATA[0..3]
LCD_CTL:RS,E
I2C:SDA,SCL
SPI:MISO,MOSI,SCK

### Notes on the sheet
- LCD | FLASH MEM
- I2C HEADER
- BUTTONS, LEDS, FROB, BEEPER

## Sheet 6 of 6
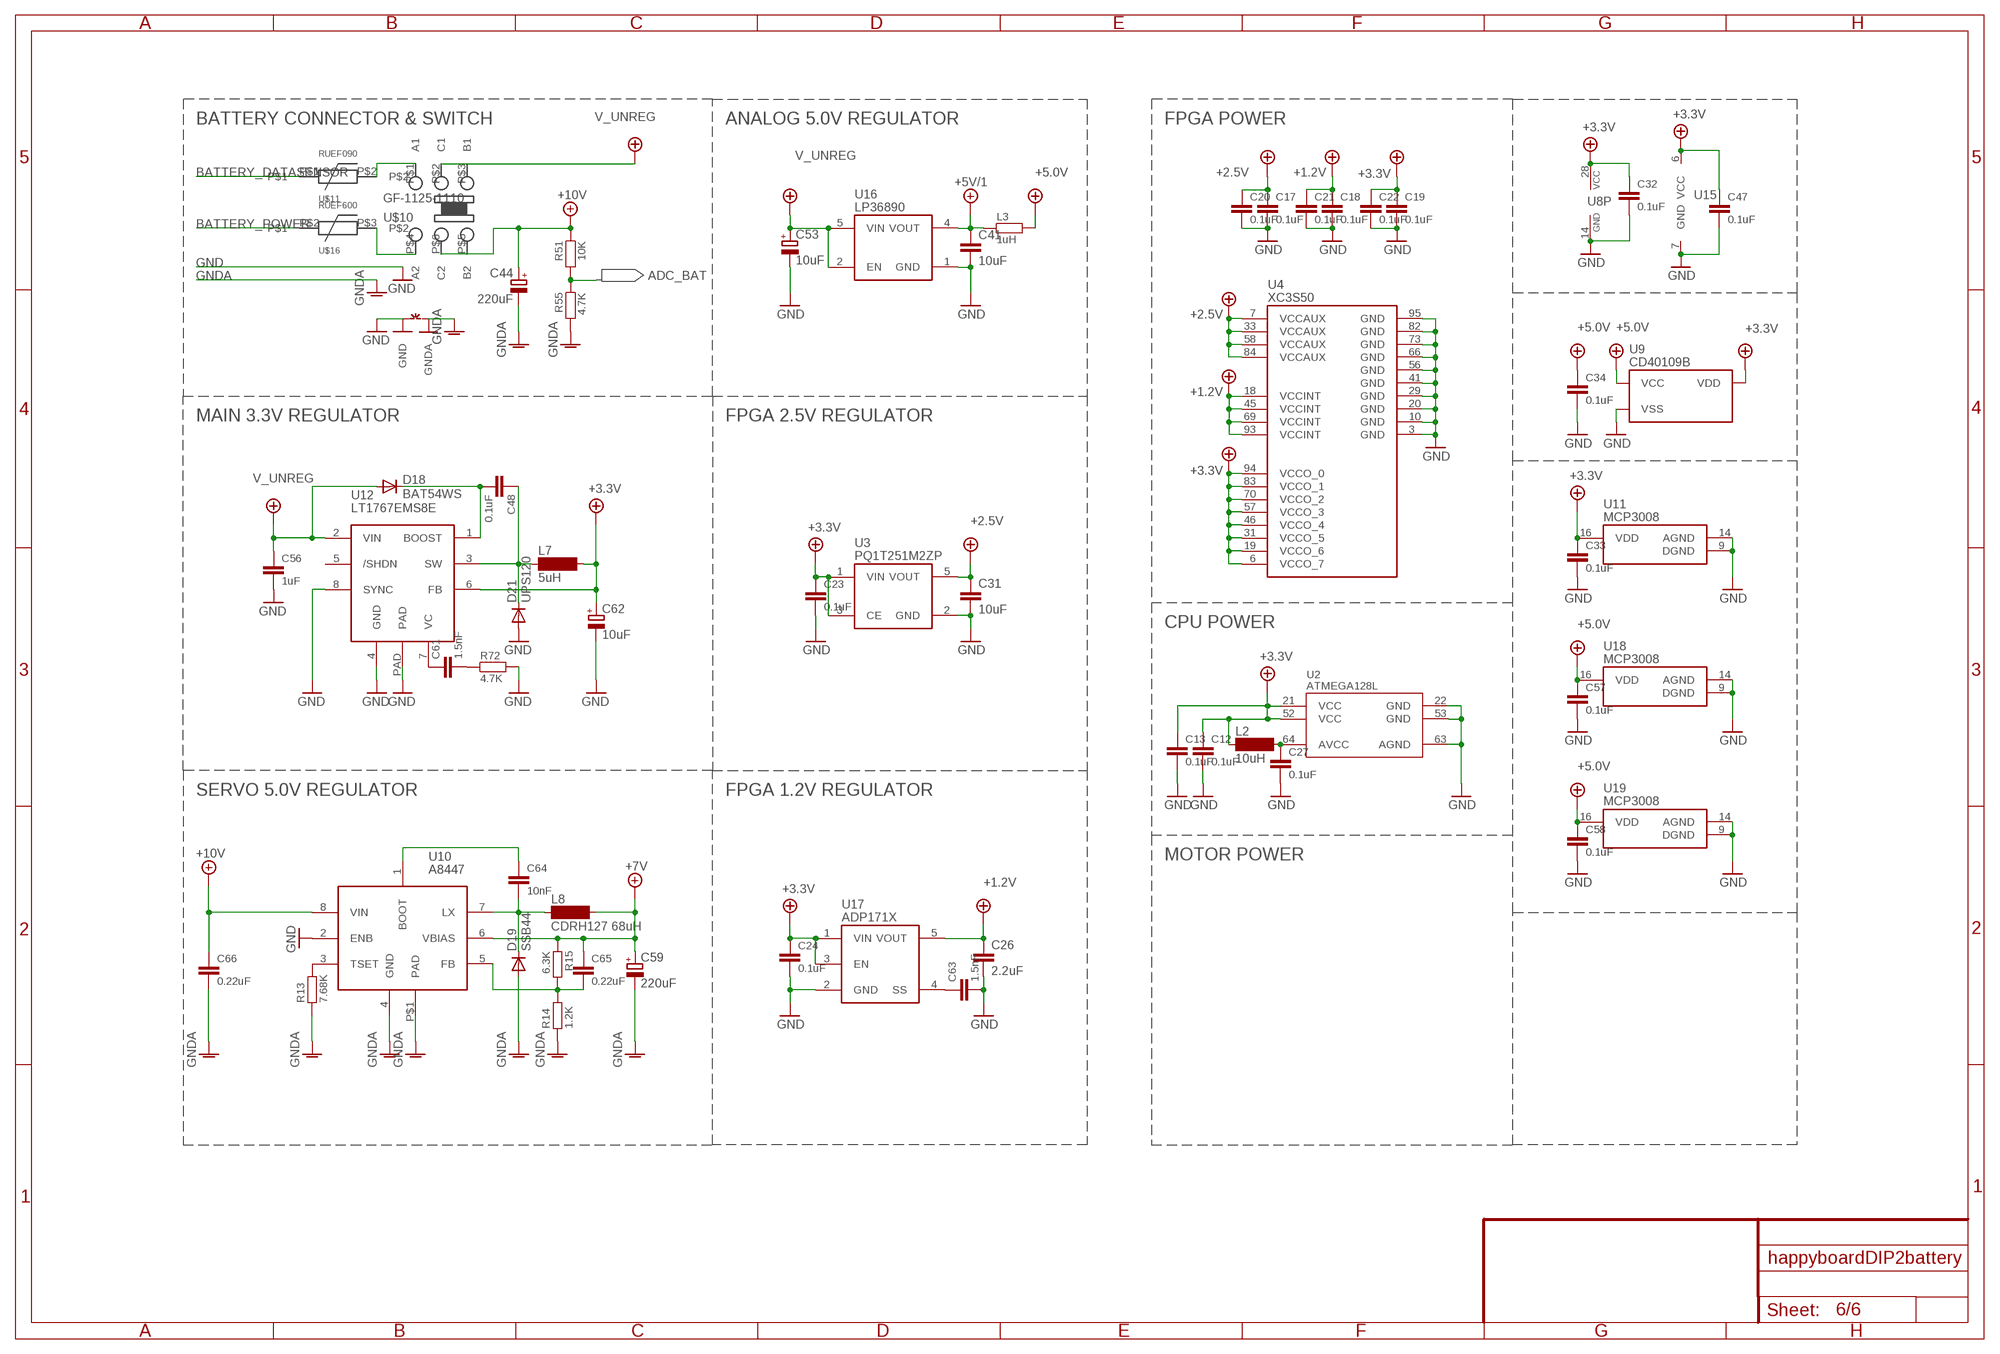
[diagram p5: schematic, sheet 6]

### Parts
C12  0.1uF  C0603  [C0603]
C13  0.1uF  C0603  [C0603]
C17  0.1uF  C0603  [C0603]
C18  0.1uF  C0603  [C0603]
C19  0.1uF  C0603  [C0603]
C20  0.1uF  C0603  [C0603]
C21  0.1uF  C0603  [C0603]
C22  0.1uF  C0603  [C0603]
C23  0.1uF  C0603  [C0603]
C24  0.1uF  C0603  [C0603]
C26  2.2uF  C-1206  [C1206]
C27  0.1uF  C0603  [C0603]
C31  10uF  C-1206  [C1206]
C32  0.1uF  C0603  [C0603]
C33  0.1uF  C0603  [C0603]
C34  0.1uF  C0603  [C0603]
C41  10uF  C-1206  [C1206]
C44  220uF  CPOL-EU153CLV-0605  [153CLV-0605]
C47  0.1uF  C0603  [C0603]
C48  0.1uF  C0603  [C0603]
C53  10uF  CPOL-EUB/3528-21R  [B/3528-21R]
C56  1uF  C0603  [C0603]
C57  0.1uF  C0603  [C0603]
C58  0.1uF  C0603  [C0603]
C59  220uF  CPOL-EU153CLV-0605  [153CLV-0605]
C61  1.5nF  C0603  [C0603]
C62  10uF  CPOL-EUB/3528-21R  [B/3528-21R]
C63  1.5nF  C0603  [C0603]
C64  10nF  C0603  [C0603]
C65  0.22uF  C0603  [C0603]
C66  0.22uF  C0603  [C0603]
D18  BAT54WS  DIODE-SOD323  [SOD323]
D19  SSB44  ES2D  [SMB]
D21  UPS120  DIODE-DO216  [DO216]
L2  10uH  SM-1206  [SM-1206]
L3  1uH  R1206  [R1206]
L7  5uH  CDRH5D18  [CDRH5D18]
L8  CDRH127 68uH  CDRH127  [CDRH127]
R13  7.68K  R0603  [R0603]
R14  1.2K  R0603  [R0603]
R15  6.3K  R0603  [R0603]
R51  10K  R0603  [R0603]
R55  4.7K  R0603  [R0603]
R72  4.7K  R0603  [R0603]
U3  PQ1T251M2ZP  PQ1T  [SOT23-5]
U10  A8447  [SO-08-PAD]
U12  LT1767EMS8E  [MSOP8E]
U16  LP36890  [SOT223-5]
U17  ADP171X  [SOT23-5]
U$10  GF-1125-1110  [GF-1125-1110]
U$11  RUEF090  [RUEF090]
U$16  RUEF600  [RUEF600]
~NUDEV~1  GND-GNDA1,27MM  [GND-GNDA-1,27MM]

### Nets
+1.2V: C18.1 C21.1 C26.1 U4.18(VCCINT) U4.45(VCCINT) U4.69(VCCINT) U4.93(VCCINT) U17.5(VOUT)
+2.5V: C17.1 C20.1 C31.1 U3.5(VOUT) U4.7(VCCAUX) U4.33(VCCAUX) U4.58(VCCAUX) U4.84(VCCAUX) ; also sheet 2
+3.3V: C12.1 C13.1 C19.1 C22.1 C23.1 C24.1 C32.1 C33.1 C47.1 C62.+ L2.1 L7.P$2 U2.21(VCC) U2.52(VCC) U3.1(VIN) U3.3(CE) U4.6(VCCO_7) U4.19(VCCO_6) U4.31(VCCO_5) U4.46(VCCO_4) U4.57(VCCO_3) U4.70(VCCO_2) U4.83(VCCO_1) U4.94(VCCO_0) U8.28(P:VCC) U9.16(VDD) U11.16(2:VDD) U12.6(FB) U15.6(2:VCC) U17.1(VIN) U17.3(EN) ; also sheet 1,2,3,4,5
+5.0V: C34.1 C57.1 C58.1 L3.2 U9.1(VCC) U18.16(2:VDD) U19.16(2:VDD) ; also sheet 4
+5V/1: C41.1 L3.1 U16.4(VOUT) ; also sheet 5
+7V: C59.+ C65.1 L8.P$2 R15.1 U10.6(VBIAS)
+10V: C44.+ C66.1 R51.1 U10.8(VIN) U$10.P$5(B2) U$10.P$6(C2) ; also sheet 3
ADC_BAT: R51.2 R55.1 ; also sheet 3
BATTERY_DATASENSOR: U$11.P$1
BATTERY_POWER: U$16.P$2
GND: C12.2 C13.2 C17.2 C18.2 C19.2 C20.2 C21.2 C22.2 C23.2 C24.2 C26.2 C27.2 C31.2 C32.2 C33.2 C34.2 C41.2 C47.2 C53.- C56.2 C57.2 C58.2 C62.- C63.2 D21.A R72.2 U2.22(GND) U2.53(GND) U2.63(AGND) U3.2(GND) U4.3(GND) U4.10(GND) U4.20(GND) U4.29(GND) U4.41(GND) U4.56(GND) U4.66(GND) U4.73(GND) U4.82(GND) U4.95(GND) U8.14(P:GND) U9.8(VSS) U10.2(ENB) U11.9(2:DGND) U11.14(2:AGND) U12.4(GND) U12.8(SYNC) U12.PAD U15.7(2:GND) U16.1(GND) U17.2(GND) U18.9(2:DGND) U18.14(2:AGND) U19.9(2:DGND) U19.14(2:AGND) ~NUDEV~1.GND ; also sheet 1,2,3,4,5
GNDA: C44.- C59.- C66.2 D19.A R13.1 R14.1 R55.2 U10.4(GND) U10.P$1(PAD) ~NUDEV~1.GNDA ; also sheet 3,4
N$12: U$10.P$4(A2) U$16.P$3
N$18: U$10.P$1(A1) U$11.P$2
N$55: C27.1 L2.2 U2.64(AVCC)
N$81: C64.2 D19.C L8.P$1 U10.7(LX)
N$83: C48.2 D18.C U12.1(BOOST)
N$84: C61.1 U12.7(VC)
N$85: C61.2 R72.1
N$86: C63.1 U17.4(SS)
N$88: C48.1 D21.C L7.P$1 U12.3(SW)
N$90: R13.2 U10.3(TSET)
N$91: C64.1 U10.1(BOOT)
N$92: C65.2 R14.2 R15.2 U10.5(FB)
VUNREG: C53.+ C56.1 D18.A U12.2(VIN) U16.2(EN) U16.5(VIN) U$10.P$2(C1) U$10.P$3(B1) ; supply symbol labelled V_UNREG
Unconnected: U12.5(/SHDN)

### Notes on the sheet
- BATTERY CONNECTOR & SWITCH | ANALOG 5.0V REGULATOR | FPGA POWER
- MAIN 3.3V REGULATOR | FPGA 2.5V REGULATOR
- CPU POWER
- SERVO 5.0V REGULATOR | FPGA 1.2V REGULATOR
- MOTOR POWER

## Library data of the parts
C1-C25 C27 C30 C32-C35 C39 C40 C42 C43 C45-C48 C54-C58 C60 C61 C63-C66 = enut202:C: Capacitor
C26 C31 C41 = rng:C: Capacitor
C44 C53 C59 C62 = rcl:CPOL-EU: POLARIZED CAPACITOR, European symbol
D1 D2 D18 D21 = rng:DIODE-
D3-D16 = happyboard:LED: LED OSRAM: - CHIPLED LG R971, LG N971, LY N971, LG Q971, LY Q971, LO R971, LY R971 LH N974, LH R974 LS Q976, LO Q976, LY Q976 LO Q996 - Hyper CHIPLED LW Q18S LB Q993, LB Q99A, LB R99A - SideLED LS A670, LO A670, LY A670, LG A670, LP A670 LB A673, LV A673, LT A673, LW A673 LH A674 LY A675 LS A676, LA A676, LO A676, LY A676, LW A676 LS A679, LY A679, LG A679 - Hyper Micro SIDELED® LS Y876, LA Y876, LO Y876, LY Y876 LT Y87S - SmartLED LW L88C, LW L88S LB L89C, LB L89S, LG L890 LS L89K, LO L89K, LY L89K LS L896, LA L896, LO L896, LY L896 - TOPLED LS T670, LO T670, LY T670, LG T670, LP T670 LSG T670, LSP T670, LSY T670, LOP T670, LYG T670 LG T671, LOG T671, LSG T671 LB T673, LV T673, LT T673, LW T673 LH T674 LS T676, LA T676, LO T676, LY T676, LB T676, LH T676, LSB T676, LW T676 LB T67C, LV T67C, LT T67C, LS T67K, LO T67K, LY T67K, LW E67C LS E67B, LA E67B, LO E67B, LY E67B, LB E67C, LV E67C, LT E67C LW T67C LS T679, LY T679, LG T679 LS T770, LO T770, LY T770, LG T770, LP T770 LB T773, LV T773, LT T773, LW T773 LH T774 LS E675, LA E675, LY E675, LS T675 LS T776, LA T776, LO T776, LY T776, LB T776 LHGB T686 LT T68C, LB T68C - Hyper Mini TOPLED® LB M676 - Mini TOPLED Santana® LG M470 LS M47K, LO M47K, LY M47K Source: http://www.osram.convergy.de/
D19 = cb-diode:ES2D: DIODE super fast rectifier, 2 A
DISP1 = happyboard:16X2LCD
J1 = happyboard:FE14-1: FEMALE HEADER
J2 J12 = happyboard:FE04-1: FEMALE HEADER
J4 = con-hirose:A3C-8DA
J5-J7 = happyboard:FE06-1: FEMALE HEADER
J8 = happyboard:FE08-1: FEMALE HEADER
J9 = happyboard:FE08-2: FEMALE HEADER
J10 = happyboard:FE16-1
J11 = happyboard:FE16-2
J13 = happyboard:FE04-2: FEMALE HEADER
J14 = happyboard:MA06-1: PIN HEADER
J15 = happyboard:MA06-2: PIN HEADER
J16 = rng:MINIUSB
L1 L2 = inductor-neosid:SM-1206: INDUCTOR SMD chip inductor
L3 R1-R15 R40-R48 R50-R62 R66 R71 R72 = enut202:R: Resistor
L7 = rng:CDRH5D18
L8 = rng:CDRH127
Q2 = rng:CITIZEN-CRYSTAL
Q4 = rng:CRYSTAL: CRYSTAL
RN1-RN7 = rng:4R-N: Array Chip Resistor Source: RS Component / Phycomp
S2 S3 = rng:TL3301: OMRON SWITCH
SV1 = SparkFun:M08: Header 8 Standard 8-pin 0.1" header. Use with straight break away headers (SKU : PRT-00116), right angle break away headers (PRT-00553), swiss pins (PRT-00743), machine pins (PRT-00117), and female headers (PRT-00115).
SW1 SW2 = special:SW_DIP-4: DIP SWITCH
U1 = ftdi4:FT232RL
U2 = enut202:ATMEGA128: IC - Atmel AVR Microcontroller
U3 = rng:PQ1T
U4 = happyboard:XC3S50
U5-U7 = rng:L6205: DUAL DMOS FULL BRIDGE MOTOR DRIVER
U8 = rng:CY7C199
U9 = rng:CD40109B
U10 = rng:A8447
U11 U18 U19 = happyboard:MCP3008
U12 = rng:LT1767
U13 = happyboard:GTL2010
U15 = atmel:AT45DB011B
U16 = rng:LP36890
U17 = rng:ADP171X
U20 = rng:MCP130T
U$10 = 00TshenLib:GF-1125-1110
U$11 = 00TshenLib:RUEF090
U$16 = 00TshenLib:RUEF600: Polyswitch 6A continuous 12A open circuit
VR1 = rng:FROBKNOB
~NUDEV~1 = ground-junctions:GND-GNDA: Connect GND - GNDA without DRC-Error, display layer 53 (54) to make copper (ROUTE) from GND to GNDA Select also layer 53 (54) in CAM-Job!